# EasyEDA Pro project ProPrj_Y车Y形板_2025-09-30.epro, schematic 原理图
Board Name: 1六边形主控板; Create Date: 2025-05-24; Page Name: 六边形主板; Project Name: Y车Y形板; Schematic Name: 原理图; Update Date: 2025-05-25; Company: 嘉立创EDA; Page Size: A4; Version: V1.0
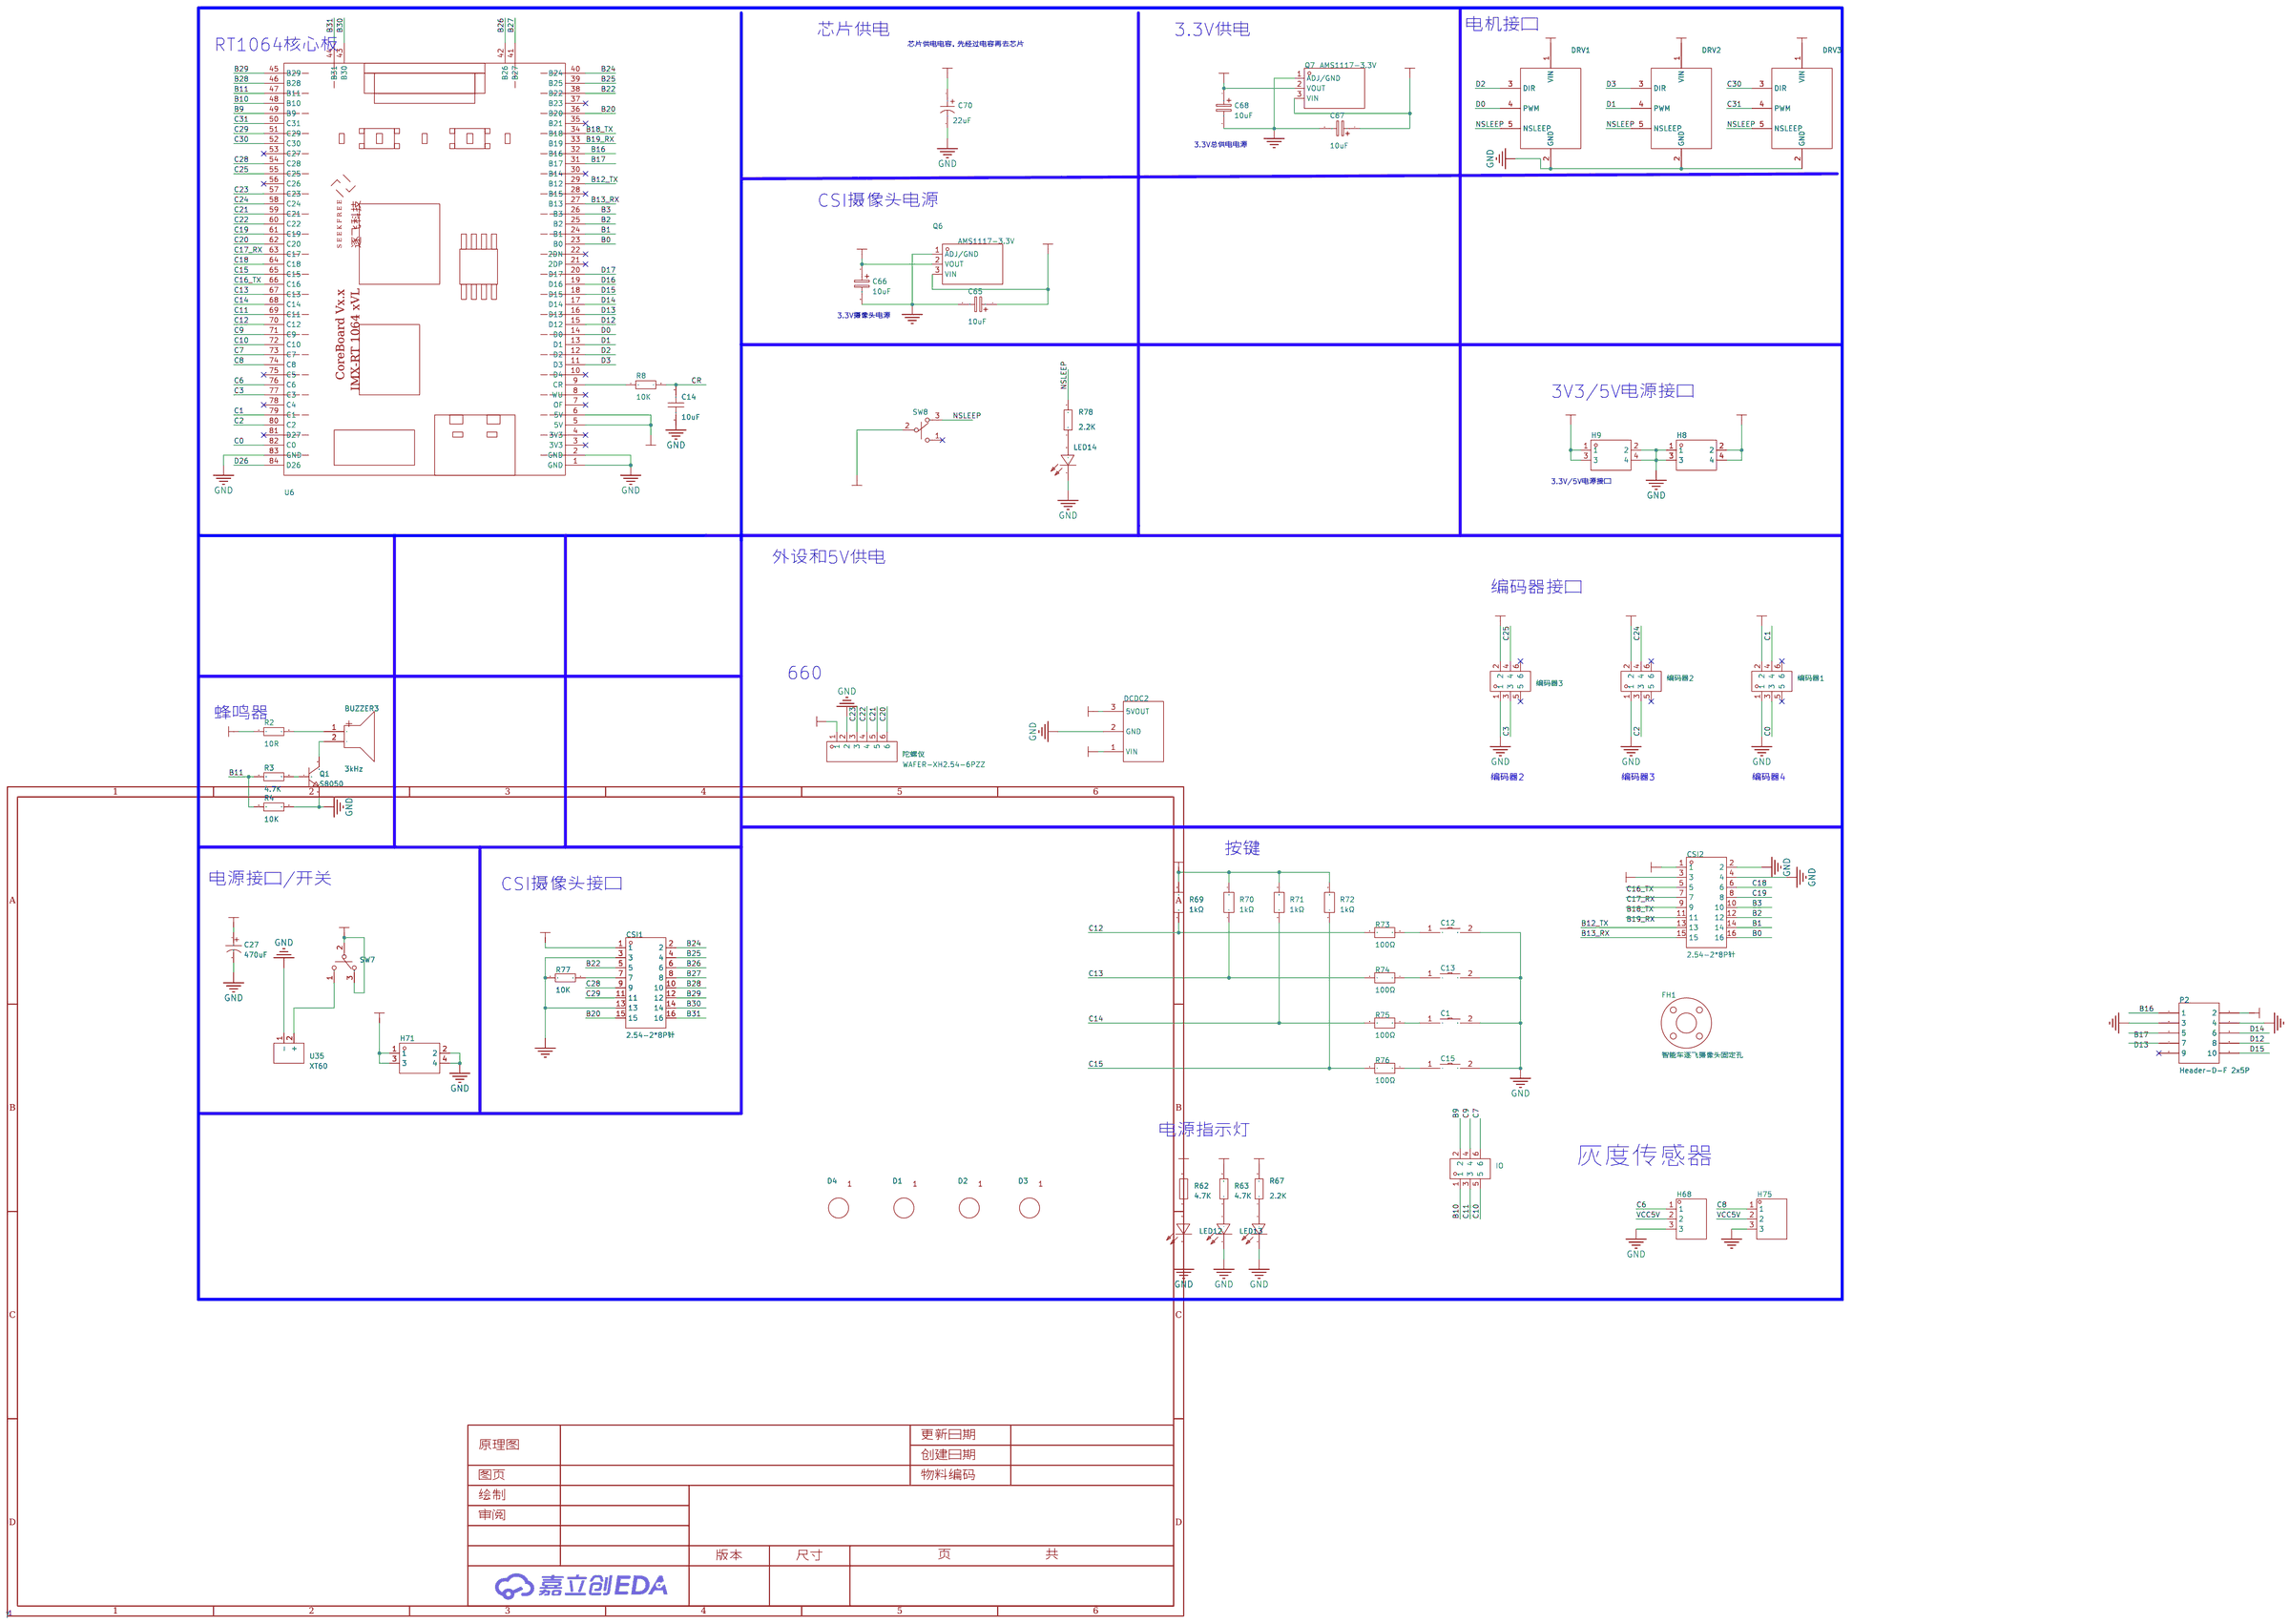
[diagram p3: schematic sheet]

## Parts
BUZZER3  3kHz  [BUZ-TH_BD9.0-P5.00-D0.6-FD]
C1  TS-1101-C-W  [SW-SMD_L6.0-W3.3-LS8.0]
C12  TS-1101-C-W  [SW-SMD_L6.0-W3.3-LS8.0]
C13  TS-1101-C-W  [SW-SMD_L6.0-W3.3-LS8.0]
C14  10uF  [C0805]
C15  TS-1101-C-W  [SW-SMD_L6.0-W3.3-LS8.0]
C27  470uF  [CAP-SMD_BD6.3-L6.6-W6.6-LS7.2-FD]
C65  10uF  [CAP-SMD_L3.5-W2.8-R-RD]
C66  10uF  [CAP-SMD_L3.5-W2.8-R-RD]
C67  10uF  [CAP-SMD_L3.5-W2.8-R-RD]
C68  10uF  [CAP-SMD_L3.5-W2.8-R-RD]
C70  22uF  [CAP-SMD_L3.2-W1.6]
CSI1  2.54-2*8P针  [HDR-TH_16P-P2.54-V-M-R2-C8-S2.54]
CSI2  2.54-2*8P针  [HDR-TH_16P-P2.54-V-M-R2-C8-S2.54]
D1  -  [M3]
D2  -  [M3]
D3  -  [M3]
D4  -  [M3]
DCDC2  -  [TPS54540DC插槽]
DRV1  -  [DRV8701连接焊盘]
DRV2  -  [DRV8701连接焊盘]
DRV3  -  [DRV8701连接焊盘]
FH1  智能车逐飞摄像头固定孔  [智能车逐飞摄像头支架固定孔]
H8  -  [HDR-TH_4P-P2.54-V-M-R2-C2-S2.54-1]
H9  -  [HDR-TH_4P-P2.54-V-M-R2-C2-S2.54-1]
H68  77311-102-03LF  [HDR-TH_3P-P2.54-V-M-1]
H71  -  [HDR-TH_4P-P2.54-V-M-R2-C2-S2.54-1]
H75  77311-102-03LF  [HDR-TH_3P-P2.54-V-M-1]
IO  67997-206HLF  [HDR-TH_6P-P2.54-V-M-R2-C3-S2.54-1]
LED10  NCD0805R1  [LED0805-RD]
LED12  NCD0805R1  [LED0805-RD]
LED13  NCD0805R1  [LED0805-RD]
LED14  NCD0805R1  [LED0805-RD]
P2  Header-D-F 2x5P  [HDR2X5-F]
Q1  S8050  [SOT-23-3_L2.9-W1.3-P1.90-LS2.4-BR]
Q6  AMS1117-3.3V  [AMS1117]
Q7  AMS1117-3.3V  [AMS1117]
R2  10R  [R0805]
R3  4.7K  [R0805]
R4  10K  [R0805]
R8  10K  [R0805]
R62  4.7K  [R0805]
R63  4.7K  [R0805]
R67  2.2K  [R0805]
R69  1kΩ  [R0805]
R70  1kΩ  [R0805]
R71  1kΩ  [R0805]
R72  1kΩ  [R0805]
R73  100Ω  [R0805]
R74  100Ω  [R0805]
R75  100Ω  [R0805]
R76  100Ω  [R0805]
R77  10K  [R0805]
R78  2.2K  [R0805]
SW7  MT-0-103-A101-M200-RS+PJ  [SW-TH_MT-0-103-A101-M200-RS]
SW8  MT-0-103-A101-M200-RS+PJ  [SW-TH_MT-0-103-A101-M200-RS]
U6  -  [AUFE_RT1064]
U35  XT60  [CONN-TH_XT60]
编码器1  67997-206HLF  [HDR-TH_6P-P2.54-V-M-R2-C3-S2.54-1]
编码器2  67997-206HLF  [HDR-TH_6P-P2.54-V-M-R2-C3-S2.54-1]
编码器3  67997-206HLF  [HDR-TH_6P-P2.54-V-M-R2-C3-S2.54-1]
陀螺仪  WAFER-XH2.54-6PZZ  [CONN-TH_XH2.54-6P]

## Library data of the parts
BUZZER3 = HNB09A03: 驱动方式:有源(内含驱动线路);构造类型:电磁式;频率:3kHz;声压(SPL):85dB@10cm;; LCSC Part Name: 电磁式有源一体蜂鸣器HNB09A03; Supplier Part: C96102; Manufacturer: 华能; Supplier Footprint: 插件,D=9mm; JLCPCB Part Class: 扩展库; Datasheet: https://atta.szlcsc.com/upload/public/pdf/source/20170522/1495448326172.pdf; Supplier: LCSC; Oscillator Circuit: 有源(内含驱动线路); Technology Type: 电磁式; Operating Voltage: 1.5V~4.5V; Current Consumption: 30mA; Sound Pressure Level (SPL): 85dB@10cm; Diameter (φD): 9mm; Height: 5.5mm; Operating Temperature: -20℃~+70℃
C1 C12 C13 C15 = TS-1101-C-W: 触点电流:50mA;额定电压(DC):12V;绝缘电阻:-;电路结构:单刀单掷;安装方式:立贴;按钮形状:矩形按钮;按钮/盖帽颜色:白色;带灯:无;作用力:260gf;机械寿命:50000;工作温度:-30℃~+85℃;开关长度:6mm;开关宽度:3.6mm;开关高度:2.5mm;带支架:否;; LCSC Part Name: TS-1101-C-W 一型3*6*2.5有白ZD b拉伸白色按键 卷装; Supplier Part: C318938; Manufacturer: XKB Connectivity(中国星坤); Supplier Footprint: SMD; JLCPCB Part Class: Extended Part; Datasheet: https://atta.szlcsc.com/upload/public/pdf/source/20200227/C318938_C2E53B1EEDE37D980A33616AC086DE53.pdf; Supplier: LCSC; Contact Current: 50mA; Voltage Rating (DC): 12V; Circuit: 单刀单掷; Mounting Style: 立贴; Actuator Style: 矩形按钮; Actuator/Cap Color: 白色; With Lamp: 无; Operating Force: 260gf; Mechanical Life: 50000; Operating Temperature: -30℃~+85℃; Switch Length: 6mm; Switch Width: 3.6mm; Switch Height: 2.5mm; Strike Gundam: 否
C14 = CAP_0805: Supplier Footprint: 0805
C27 = KM477M050G20RR0VH2FP0: 容值:470uF;精度:±20%;额定电压:50V;电容体直径:10mm;电容体长度:20mm;脚间距:5mm;工作寿命:2000hrs@105℃;; LCSC Part Name: 470uF ±20% 50V; Supplier Part: C34642; Manufacturer: CX(承兴); Supplier Footprint: 直插,D10xL20mm; JLCPCB Part Class: Extended Part; Datasheet: https://atta.szlcsc.com/upload/public/pdf/source/20211027/06D6BA3719C264B639DC286D935D03EA.pdf; Supplier: LCSC; Tolerance: ±20%; Rated Voltage: 50V; φD: 10mm; L: 20mm; Lead Spacing: 5mm; Lifetime @ Temp: 2000hrs@105℃
C65-C68 = CA45-B-16V-10μF-K: 容值:10uF;精度:±10%;额定电压:16V;等效串联电阻:2.8Ω@100kHz;; LCSC Part Name: 10uF ±10% 16V; Supplier Part: C503899; Manufacturer: TORCH(火炬); Supplier Footprint: CASE-B-3528; JLCPCB Part Class: 扩展库; Datasheet: https://atta.szlcsc.com/upload/public/pdf/source/20200527/C503899_E68A547A52C2BA3860090FD06476D5DC.pdf; Supplier: LCSC; Tolerance: ±10%; Rated Voltage: 16V; Equivalent Series Resistance(ESR): 2.8Ω@100kHz; Operating Temperature: -55℃~+125℃
C70 = CA45-A-16V-22uF-K: 容值:22uF;精度:±10%;额定电压:16V;等效串联电阻:6Ω@100kHz;; LCSC Part Name: 22uF ±10% 16V; Supplier Part: C782264; Manufacturer: CEC(振华新云); Supplier Footprint: CASE-A-3216; JLCPCB Part Class: 扩展库; Datasheet: https://atta.szlcsc.com/upload/public/pdf/source/20200909/C782264_D6D9C4EF3B25E81633C26A9294FBB820.pdf; Supplier: LCSC; Tolerance: ±10%; Rated Voltage: 16V; Equivalent Series Resistance(ESR): 6Ω@100kHz; Operating Temperature: -55℃~+125℃
CSI1 CSI2 = 2.54-2*8P针_C779499: 圆针/方针:-;额定电流:-;额定电压:-;配合针长度:-;塑高:-;触头材质:-;; LCSC Part Name: 双排直插 2*8排针 2.54mm; Supplier Part: C779499; Manufacturer: BOOMELE(博穆精密); Supplier Footprint: 插件,P=2.54mm; JLCPCB Part Class: 扩展库; Datasheet: https://atta.szlcsc.com/upload/public/pdf/source/20221201/C605E3BE9C0F7226363017EFD1BDE852.pdf; Supplier: LCSC
D1-D4 = 定位孔1
DCDC2 = TPS54540DC模块
DRV1-DRV3 = DRV8901驱动连接焊盘
FH1 = 智能车逐飞摄像头固定孔: 3DModel: 逐飞摄像头法兰盘-Body
H8 H9 H71 = HDR-M_2.54_2x2: Supplier Part: C160338; Supplier Footprint: 插件,P=2.54mm
H68 H75 = 77311-102-03LF: 排数:单排;总PIN位数:-;间距:2.54mm;插针结构:-;行距:-;安装类型:直插;圆针/方针:方针;额定电流:-;额定电压:-;配合针长度:-;塑高:2.54mm;触头材质:磷青铜;触头镀层:-;颜色:黑色;; LCSC Part Name: 2.54mm 直插 方针; Supplier Part: C180248; Manufacturer: Amphenol; Supplier Footprint: 直插,P=2.54mm; JLCPCB Part Class: Extended Part; Datasheet: https://atta.szlcsc.com/upload/public/pdf/source/20180329/C180248_62E264527695F7ED58561BB828D45E42.pdf; Supplier: LCSC; Number of Rows: 单排; Pitch: 2.54mm; Mounting Type: 直插; Circluar Pins/Square Pins: 方针; Insulation Height: 2.54mm; Contact Material: 磷青铜; Color: 黑色
IO 编码器1-编码器3 = 67997-206HLF: 排数:双排;总PIN位数:-;间距:2.54mm;插针结构:-;行距:2.54mm;安装类型:直插;圆针/方针:方针;额定电流:-;额定电压:-;配合针长度:-;塑高:2.54mm;触头材质:磷青铜;触头镀层:-;颜色:黑色;; LCSC Part Name: 2.54mm 直插 方针; Supplier Part: C236051; Manufacturer: Amphenol; Supplier Footprint: 插件,P=2.54mm; JLCPCB Part Class: Extended Part; Datasheet: https://atta.szlcsc.com/upload/public/pdf/source/20180628/C236051_0392958A7E48808CEC9642DF7CCB05DE.pdf; Supplier: LCSC; Number of Rows: 双排; Pitch: 2.54mm; Row Spacing: 2.54mm; Mounting Type: 直插; Circluar Pins/Square Pins: 方针; Insulation Height: 2.54mm; Contact Material: 磷青铜; Color: 黑色
LED10 LED12-LED14 = NCD0805R1: 发光颜色:红灯;; LCSC Part Name: 红灯; Supplier Part: C84256; Manufacturer: 国星光电; Supplier Footprint: 0805; JLCPCB Part Class: Basic Part; Datasheet: https://atta.szlcsc.com/upload/public/pdf/source/20200820/C84256_F0A75A43B3EAD75808600A0514C76B99.pdf; Supplier: LCSC; Emitted Color: 红灯
P2 = Header-D-F 2x5P: Revision: V1.0
Q1 = S8050_C2762211: 晶体管类型:NPN;集射极击穿电压(Vceo):25V;集电极电流(Ic):500mA;功率(Pd):300mW;集电极-发射极饱和电压(VCE(sat)@Ic,Ib):600mV@500mA,50mA;直流电流增益(hFE@Ic,Vce):120@50mA,1V;特征频率(fT):150MHz;工作温度:-55℃~+150℃@(Tj);; Supplier Part: C2762211; Manufacturer: 晶导微电子; Supplier Footprint: SOT-23; JLCPCB Part Class: Extended Part; Datasheet: https://atta.szlcsc.com/upload/public/pdf/source/20210521/C2762211_5AC5D762C14CC7F013712CBEE509B0DC.pdf; Supplier: LCSC; Transistor Type: NPN; Collector-Emitter Breakdown Voltage (Vceo): 25V; Collector Current (Ic): 500mA; Power Dissipation (Pd): 300mW; Collector-Emitter Saturation Voltage (VCE(sat)@Ic,Ib): 600mV@500mA,50mA; DC Current Gain (hFE@Ic,Vce): 120@50mA,1V; Transition Frequency (fT): 150MHz; Operating Temperature: -55℃~+150℃@(Tj)
Q6 Q7 = AMS1117-3.3V_C5120796: 输出类型:固定;最大输入电压:18V;输出电压:3.3V;最大输出电流:1A;输出极性:正极;; LCSC Part Name: 输入18V 输出3.3V 1A; Supplier Part: C5120796; Manufacturer: MSKSEMI(美森科); Supplier Footprint: SOT-89; JLCPCB Part Class: 扩展库; Datasheet: https://atta.szlcsc.com/upload/public/pdf/source/20231123/6117526697EB8BF6175FDEEBA0877266.pdf; Supplier: LCSC; Output Type: 固定; Maximum Input Voltage: 18V; Output Voltage: 3.3V; MAX Output Current: 1A; Dropout Voltage: 1.4V@(1A); standby current: 12mA; Operating Temperature: 0℃~+125℃; Output Polarity: 正极; Number of Outputs: 1
R2-R4 R8 R62 R63 R67 R77 R78 = Res_0805: Supplier Footprint: 0805
R69-R76 = RC0805FR-0718K7L: 电阻类型:厚膜电阻;阻值:18.7kΩ;精度:±1%;功率:125mW;最大工作电压:150V;温度系数:±100ppm/℃;; LCSC Part Name: 厚膜电阻 18.7kΩ ±1% 125mW; Supplier Part: C273880; Manufacturer: YAGEO(国巨); Supplier Footprint: 0805; JLCPCB Part Class: 扩展库; Datasheet: https://atta.szlcsc.com/upload/public/pdf/source/20191125/C364360_EA870FADD46A2AD4DBE56DD50D360B3E.pdf; Supplier: LCSC; Type: 厚膜电阻; Tolerance: ±1%; Power(Watts): 125mW; Overload Voltage (Max): 150V; Temperature Coefficient: ±100ppm/℃; Operating Temperature Range: -55℃~+155℃
SW7 SW8 = MT-0-103-A101-M200-RS+PJ: 额定电流:5A;额定电压(AC):125V;电路结构:单刀双掷;钮柄形状:圆柱钮柄;引脚样式:焊片;安装方式:直插;工作温度:-25℃~+85℃;开关长度:13mm;开关宽度:8mm;开关高度:28.6mm;; LCSC Part Name: 小型钮子三脚三档(五件套); Supplier Part: C1788493; Manufacturer: YUEN FUNG(源丰); Supplier Footprint: 插件; JLCPCB Part Class: Extended Part; Datasheet: https://atta.szlcsc.com/upload/public/pdf/source/20201225/C1788493_608759AD4D4A20FF90A03E3E3321FD91.pdf; Supplier: LCSC; Contact Current: 5A; Voltage Rating (AC): 125V; Circuit: 单刀双掷; Actuator Type: 圆柱钮柄; Pin Style: 焊片; Mounting Style: 直插; Operating Temperature: -25℃~+85℃; Switch Length: 13mm; Switch Width: 8mm; Switch Height: 28.6mm
U6 = RT1064
U35 = XT60: 类别:-;类型1:-;; LCSC Part Name: AMASS(艾迈斯) XT60模型插头 3.5mm镀金香蕉头公头（电调端）XT60-M; Supplier Part: C98733; Manufacturer: AMASS(艾迈斯); JLCPCB Part Class: 扩展库; Datasheet: https://atta.szlcsc.com/upload/public/pdf/source/20170606/1496716524919.pdf; Supplier: LCSC; Brand: 艾迈斯; Type: 香蕉头; Colour: 黄色; InterfaceType: 公头; specifications: 3.5mm
陀螺仪 = WAFER-XH2.54-6PZZ: 插针结构:1x6P;间距:2.54mm;安装方式:直插;总PIN数:6P;排数:1;每排PIN数:6;额定电流:2A;工作温度范围:-25℃~+85℃;; LCSC Part Name: XH 2.54mm 1x6P 直插; Supplier Part: C5359634; Manufacturer: XUNPU(讯普); Supplier Footprint: 插件,P=2.54mm; JLCPCB Part Class: 扩展库; Datasheet: https://atta.szlcsc.com/upload/public/pdf/source/20230221/5D6483F9C7001DB87CFCFC787E1DC139.pdf; Supplier: LCSC; Pins Structure: 1x6P; Pitch: 2.54mm; Mounting Style: 直插; Number of Pins: 6P; Number of Rows: 1; Number of PINs Per Row: 6; Current Rating (Max): 2A; Operating Temperature Range: -25℃~+85℃

## Nets
3V3: C68.1 H8.2 H8.4 Q7.2(VOUT) R2.1 R67.2 R69.2 R70.2 R71.2 R72.2 SW8.2 编码器1.2 编码器2.2 编码器3.2
GND: C1.2 C12.2 C13.2 C14.1 C15.2 C27.2 C65.2 C66.2 C67.2 C68.2 C70.2 CSI1.3 CSI1.13 CSI2.2 CSI2.4 DCDC2.2(GND) DRV1.2(GND) DRV2.2(GND) DRV3.2(GND) H8.1 H8.3 H9.2 H9.4 H68.3 H71.2 H71.4 H75.3 LED10.1(-) LED12.1(-) LED13.1(-) LED14.1(-) P2.3 P2.4 Q1.2(E) Q6.1(ADJ/GND) Q7.1(ADJ/GND) R4.2 R77.2 U6.1(GND) U6.2(GND) U6.83(GND) U35.1(-) 编码器1.1 编码器2.1 编码器3.1 陀螺仪.2
VCC5V: C65.1 C67.1 C70.1 CSI2.1 CSI2.3 DCDC2.3(5VOUT) H9.1 H9.3 H68.2 H75.2 P2.2 Q6.3(VIN) Q7.3(VIN) R62.2 U6.5(5V) U6.6(5V) 陀螺仪.1
VCCBAT: C27.1 DCDC2.1(VIN) DRV1.1(VIN) DRV2.1(VIN) DRV3.1(VIN) H71.1 H71.3 SW7.2 SW7.3
B0: CSI2.16 U6.23(B0)
B1: CSI2.14 U6.24(B1)
B2: CSI2.12 U6.25(B2)
B3: CSI2.10 U6.26(B3)
B9: IO.2 U6.49(B9)
B10: IO.1 U6.48(B10)
B11: R3.1 R4.1 U6.47(B11)
B12_TX: CSI2.13 U6.29(B12)
B13_RX: CSI2.15 U6.27(B13)
B16: P2.1 U6.32(B16)
B17: P2.5 U6.31(B17)
B18_TX: CSI2.9 U6.34(B18)
B19_RX: CSI2.11 U6.33(B19)
B20: CSI1.15 U6.36(B20)
B22: CSI1.5 U6.38(B22)
B24: CSI1.2 U6.40(B24)
B25: CSI1.4 U6.39(B25)
B26: CSI1.6 U6.42(B26)
B27: CSI1.8 U6.41(B27)
B28: CSI1.10 U6.46(B28)
B29: CSI1.12 U6.45(B29)
B30: CSI1.14 U6.43(B30)
B31: CSI1.16 U6.44(B31)
C0: U6.82(C0) 编码器1.3
C1: U6.79(C1) 编码器1.4
C2: U6.80(C2) 编码器2.3
C3: U6.77(C3) 编码器3.3
C6: H68.1 U6.76(C6)
C7: IO.6 U6.73(C7)
C8: H75.1 U6.74(C8)
C9: IO.4 U6.71(C9)
C10: IO.5 U6.72(C10)
C11: IO.3 U6.69(C11)
C12: R69.1 R73.2 U6.70(C12)
C13: R70.1 R74.2 U6.67(C13)
C14: R71.1 R75.2 U6.68(C14)
C15: R72.1 R76.2 U6.65(C15)
C16_TX: CSI2.5 U6.66(C16)
C17_RX: CSI2.7 U6.63(C17)
C18: CSI2.6 U6.64(C18)
C19: CSI2.8 U6.61(C19)
C20: U6.62(C20) 陀螺仪.6
C21: U6.59(C21) 陀螺仪.5
C22: U6.60(C22) 陀螺仪.4
C23: U6.57(C23) 陀螺仪.3
C24: U6.58(C24) 编码器2.4
C25: U6.55(C25) 编码器3.4
C28: CSI1.9 U6.54(C28)
C29: CSI1.11 U6.51(C29)
C30: DRV3.3(DIR) U6.52(C30)
C31: DRV3.4(PWM) U6.50(C31)
CR: C14.2 R8.2
CSI-3V3: C66.1 CSI1.1 Q6.2(VOUT) R63.2
D0: DRV1.4(PWM) U6.14(D0)
D1: DRV2.4(PWM) U6.13(D1)
D2: DRV1.3(DIR) U6.12(D2)
D3: DRV2.3(DIR) U6.11(D3)
D12: P2.8 U6.15(D12)
D13: P2.7 U6.16(D13)
D14: P2.6 U6.17(D14)
D15: P2.10 U6.18(D15)
D16: U6.19(D16)
D17: U6.20(D17)
D26: U6.84(D26)
NSLEEP: DRV1.5(NSLEEP) DRV2.5(NSLEEP) DRV3.5(NSLEEP) R78.2 SW8.3
$3N5765: Q1.1(B) R3.2
$3N5766: BUZZER3.2(-) Q1.3(C)
$3N5940: BUZZER3.1(+) R2.2
$3N5970: CSI1.7 R77.1
$3N6012: R8.1 U6.9(CR)
$3N6112: LED12.2(+) R62.1
$3N6115: LED13.2(+) R63.1
$3N6127: LED10.2(+) R67.1
$3N16320: SW7.1 U35.2(+)
$3N36316: C12.1 R73.1
$3N36361: C13.1 R74.1
$3N36406: C1.1 R75.1
$3N36446: C15.1 R76.1
$3N48482: LED14.2(+) R78.1

Not connected (* = marked no-connect by the designer): P2 9*; SW8 1*; U6 3(3V3)* 4(3V3)* 7(OF)* 8(WU)* 10(D4)* 21(2DP)* 22(2DN)* 28(B15)* 30(B14)* 35(B21)* 37(B23)* 53(C27)* 56(C26)* 75(C5)* 78(C4)* 81(D27)*; 编码器1 5* 6*; 编码器2 5* 6*; 编码器3 5* 6*

## Notes on the sheet
- 电机接口
- 芯片供电
- 芯片供电电容，先经过电容再去芯片
- 3.3V供电
- RT1064核心板
- 3.3V总供电电源
- CSI摄像头电源
- 3.3V摄像头电源
- 3V3/5V电源接口
- 3.3V/5V电源接口
- 外设和5V供电
- 编码器接口
- 660
- 蜂鸣器
- 编码器2
- 编码器3
- 编码器4
- 按键
- 电源接口/开关
- CSI摄像头接口
- 电源指示灯
- 灰度传感器
